# EAGLE design TelosB-JTAG430 (EAGLE 5.09)
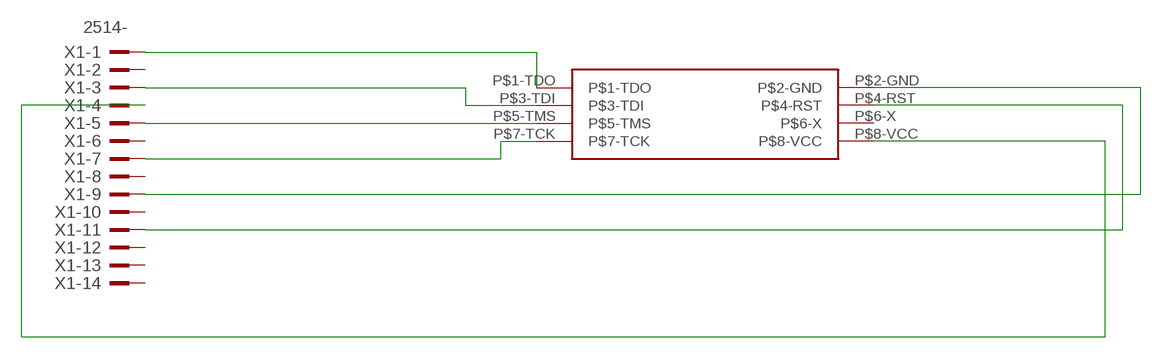
[diagram p0: schematic, sheet 1]

## Parts
U$1  2X4_METRIC_HEADER  [2X4_METRIC_HEADER]
X1  2514-  [PAK100/2500-14]

## Nets
N$1: U$1.P$1-TDO X1.1
N$2: U$1.P$7-TCK X1.7
N$3: U$1.P$3-TDI X1.3
N$4: U$1.P$5-TMS X1.5
N$5: U$1.P$2-GND X1.9
N$6: U$1.P$4-RST X1.11
N$7: U$1.P$8-VCC X1.4
Unconnected: U$1.P$6-X X1.2 X1.6 X1.8 X1.10 X1.12 X1.13 X1.14

## Library data of the parts
U$1 = fabien:2X4_METRIC_HEADER
X1 = con-3m:2514-: 3M (TM) Pak 100 4-Wall Header Source: 3M

## Board
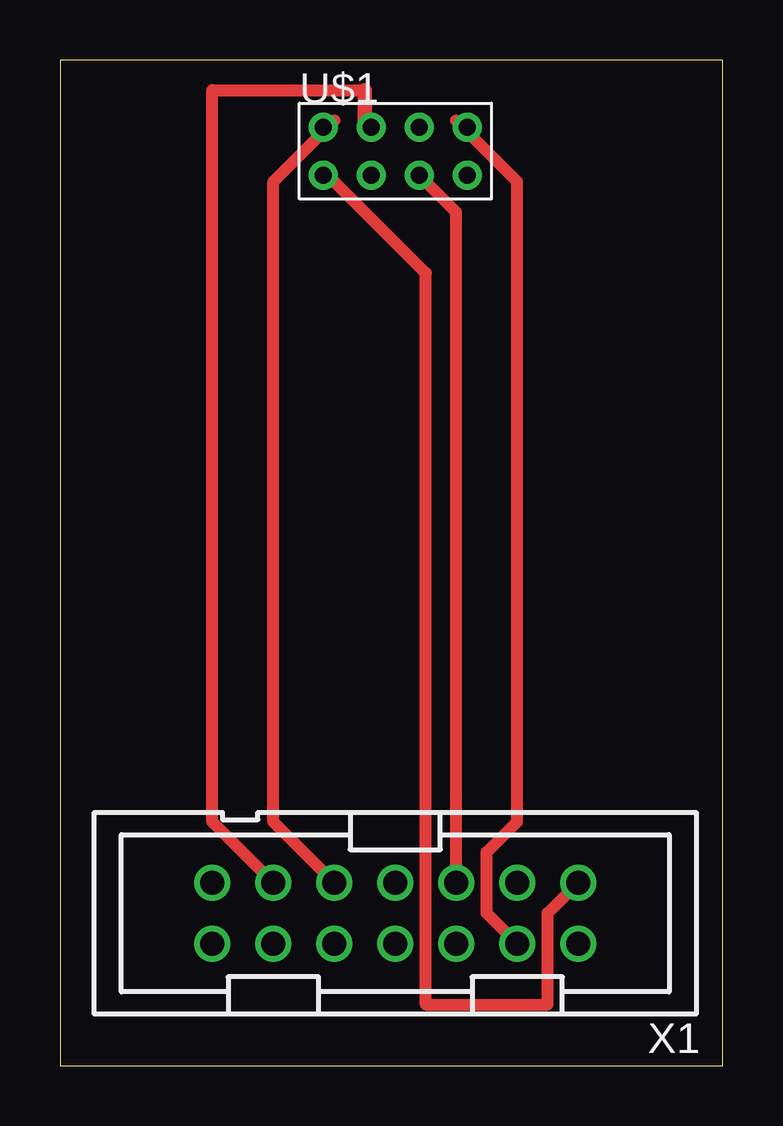
[diagram p1: board, top side]
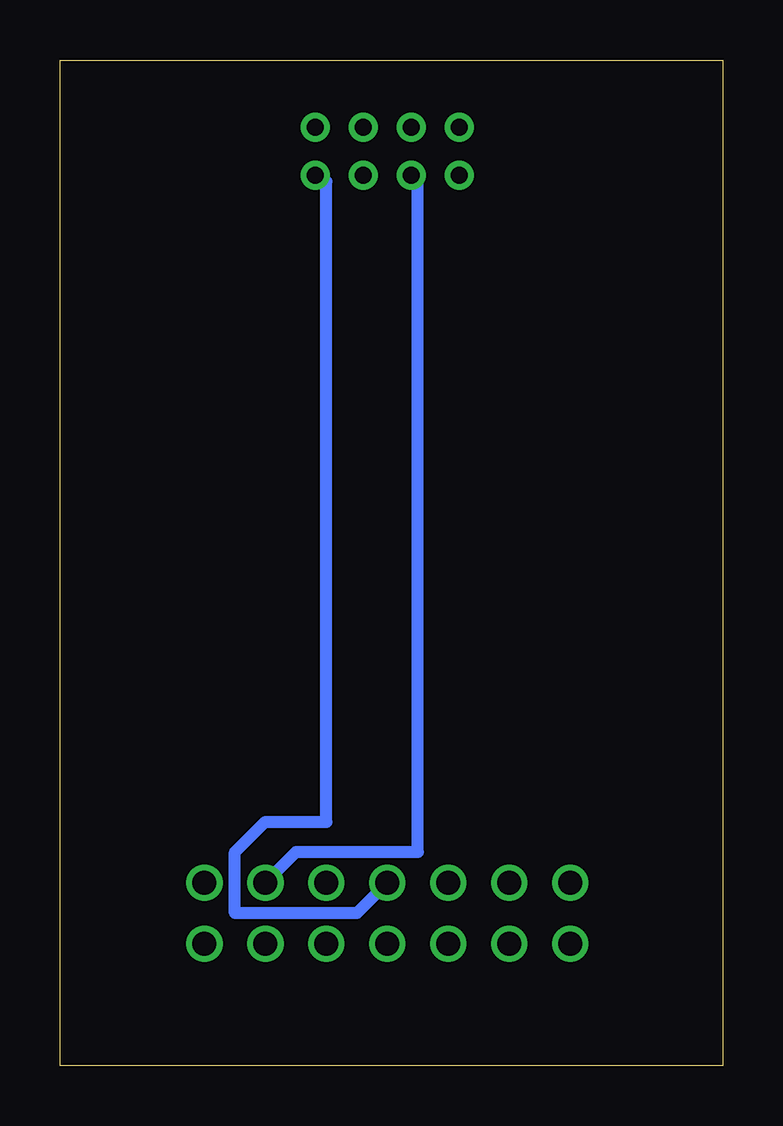
[diagram p2: board, bottom side, seen from below]

Size 27.61 x 41.9 mm. Coordinates in mm from the lower left corner, seen from the top.
Outline: 0,0 27.61,0 27.61,41.9 0,41.9 0,0
Copper layers (1*16): Top 0.035mm / dielectric 1.5mm / Bottom 0.035mm
Design rules "default *": minimum track width 20mil, minimum drill 24mil, track to track 8mil, track to pad 8mil, pad to pad 8mil, via to via 8mil, smd to smd 8mil, copper to edge 40mil, drill to drill 8mil, minimum pad ring 10mil, minimum via ring 8mil, stop-mask expansion 4mil, vias tented up to drill 0mil, thermal gap 10mil

### Footprints (pad centres in the part's own frame; a part is rotated, then mirrored left to right if it is on the bottom)
2X4_METRIC_HEADER = drill 0.7 pad 1 round: P$1-TDO -3,-1; P$2-GND -3,1; P$3-TDI -1,-1; P$4-RST -1,1; P$5-TMS 1,-1; P$6-X 1,1; P$7-TCK 3,-1; P$8-VCC 3,1
PAK100/2500-14 = drill 1 pad 1.422 round: 1 -7.62,-1.27; 2 -7.62,1.27; 3 -5.08,-1.27; 4 -5.08,1.27; 5 -2.54,-1.27; 6 -2.54,1.27; 7 0,-1.27; 8 0,1.27; 9 2.54,-1.27; 10 2.54,1.27; 11 5.08,-1.27; 12 5.08,1.27; 13 7.62,-1.27; 14 7.62,1.27

### Placement (x,y rotation side)
U$1  13.97,38.1 0 top
X1  13.97,6.35 180 top

### Tracks (layer width: path | path; a pad name or v marks a point on that pad's centre or on a via)
N$1
  Top 0.508: X1.1 20.32,6.35 20.32,2.54 15.24,2.54 15.24,33.02 11.43,36.83 U$1.P$1-TDO
N$2
  Bottom 0.508: X1.7 15.24,6.35 20.32,6.35 20.32,8.89 19.05,10.16 16.51,10.16 16.51,36.83 U$1.P$7-TCK
N$3
  Bottom 0.508: X1.3 17.78,8.89 12.7,8.89 12.7,36.83 U$1.P$3-TDI
N$4
  Top 0.508: X1.5 16.51,35.56 U$1.P$5-TMS
N$5
  Top 0.508: X1.9 8.89,10.16 8.89,36.83 11.43,39.37 U$1.P$2-GND
N$6
  Top 0.508: X1.11 6.35,10.16 6.35,40.64 12.7,40.64
  Top 0.61: 12.7,40.64 12.7,39.37 U$1.P$4-RST
N$7
  Top 0.508: X1.4 17.78,6.35 17.78,8.89 19.05,10.16 19.05,36.83 16.51,39.37 U$1.P$8-VCC